# EAGLE design lin_master_node (EAGLE 6.5.0)
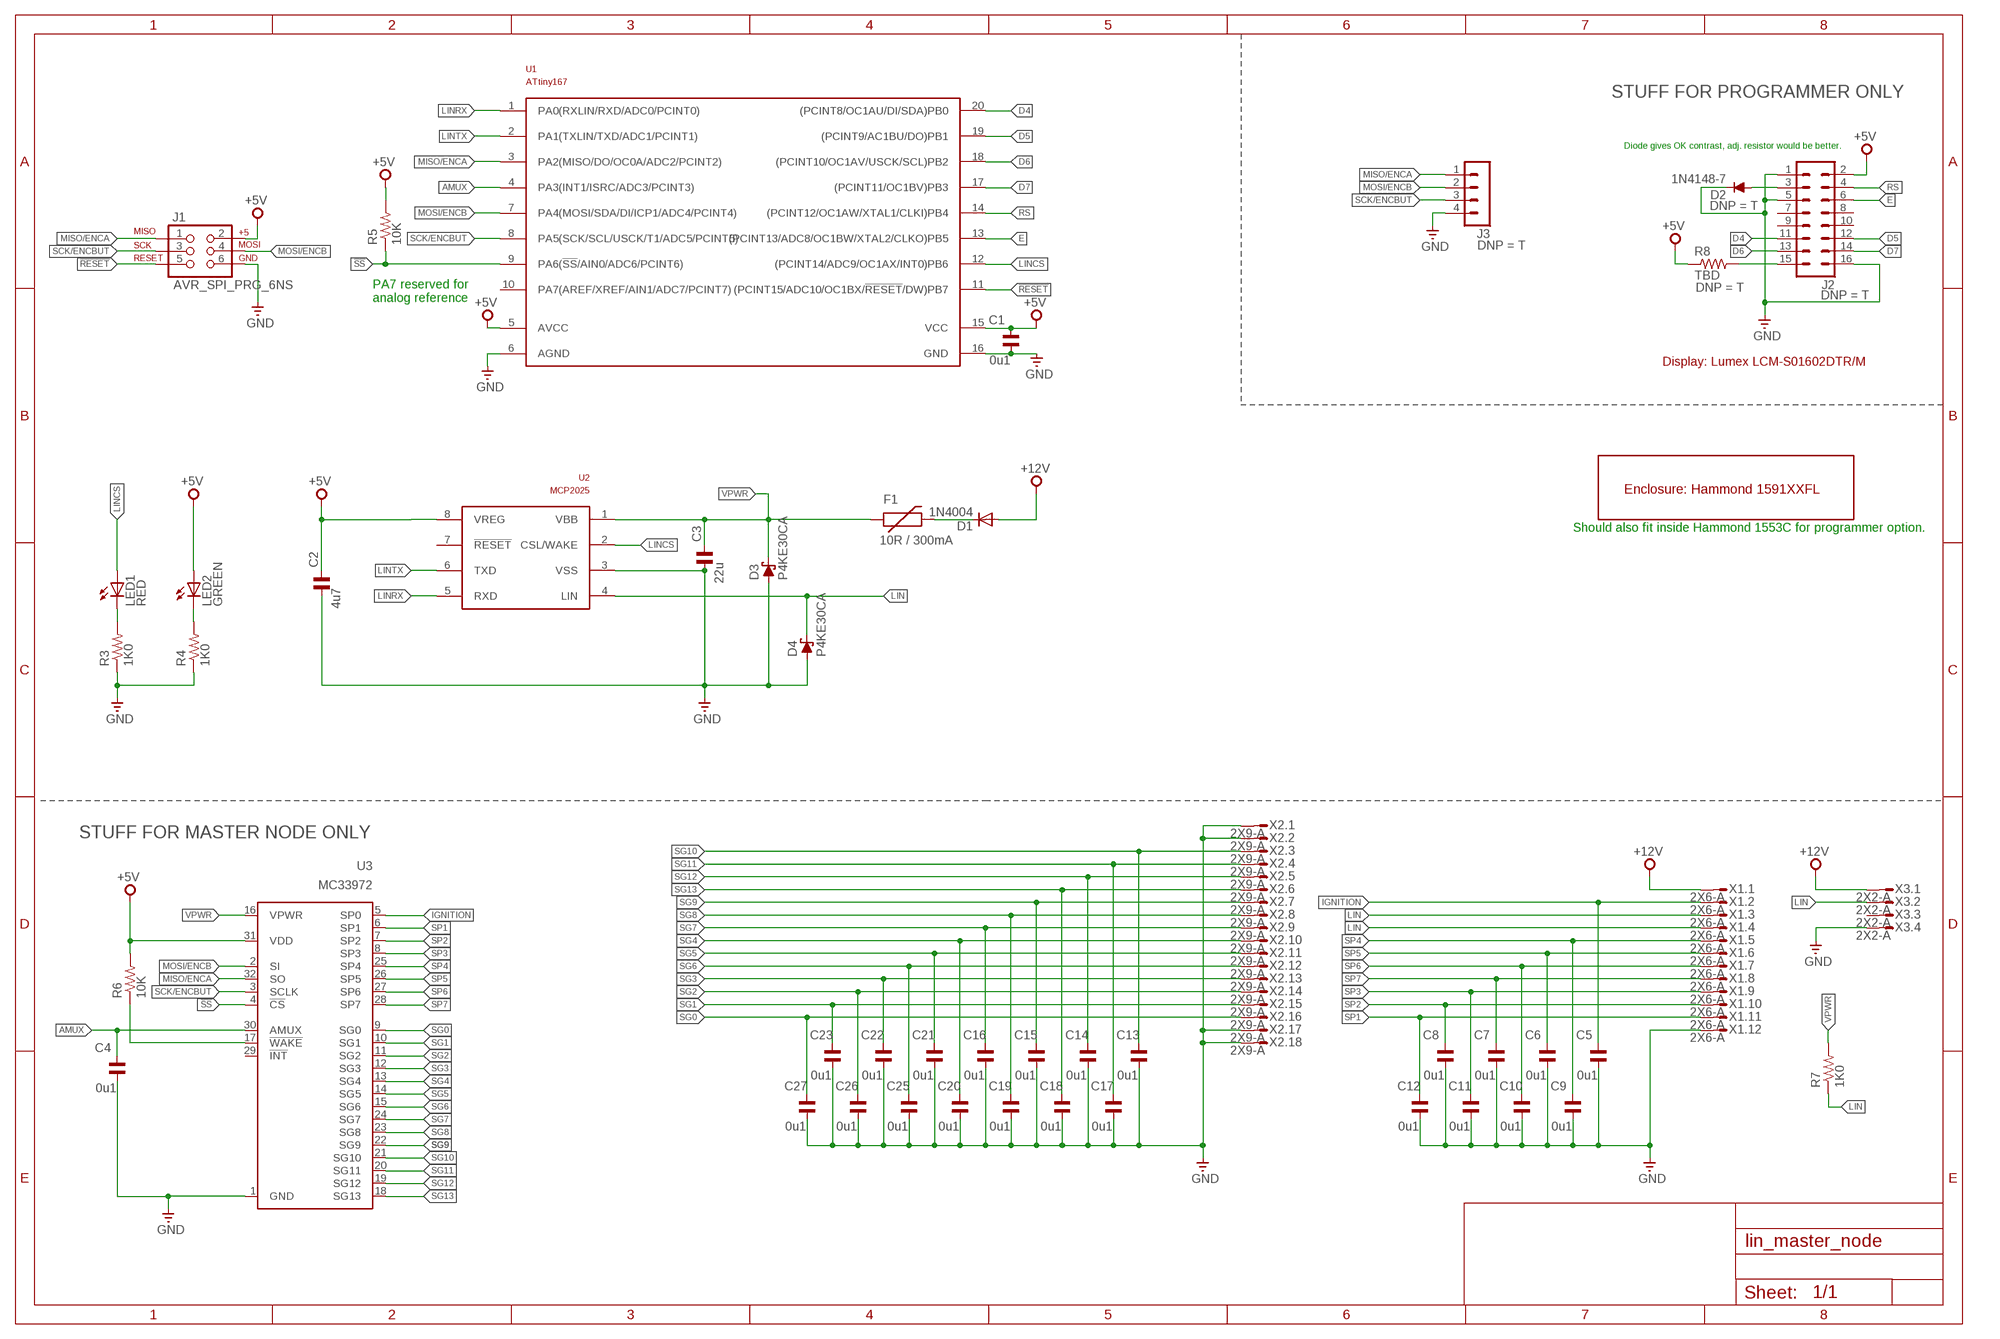
[diagram p0: schematic, sheet 1]

## Parts
C1  0u1  C-EU050-024X044  [C050-024X044]
C2  4u7  C-EU050-024X044  [C050-024X044]
C3  22u  C-EU050-024X044  [C050-024X044]
C4  0u1  C-EU050-024X044  [C050-024X044]
C5  0u1  C-EUC0603K  [C0603K]
C6  0u1  C-EUC0603K  [C0603K]
C7  0u1  C-EUC0603K  [C0603K]
C8  0u1  C-EUC0603K  [C0603K]
C9  0u1  C-EUC0603K  [C0603K]
C10  0u1  C-EUC0603K  [C0603K]
C11  0u1  C-EUC0603K  [C0603K]
C12  0u1  C-EUC0603K  [C0603K]
C13  0u1  C-EUC0603K  [C0603K]
C14  0u1  C-EUC0603K  [C0603K]
C15  0u1  C-EUC0603K  [C0603K]
C16  0u1  C-EUC0603K  [C0603K]
C17  0u1  C-EUC0603K  [C0603K]
C18  0u1  C-EUC0603K  [C0603K]
C19  0u1  C-EUC0603K  [C0603K]
C20  0u1  C-EUC0603K  [C0603K]
C21  0u1  C-EUC0603K  [C0603K]
C22  0u1  C-EUC0603K  [C0603K]
C23  0u1  C-EUC0603K  [C0603K]
C25  0u1  C-EUC0603K  [C0603K]
C26  0u1  C-EUC0603K  [C0603K]
C27  0u1  C-EUC0603K  [C0603K]
D1  1N4004  [DO41-10]
D2  1N4148-7  [DO35-7]
D3  P4KE30CA  P4KEXX  [DO41-10]
D4  P4KE30CA  P4KEXX  [DO41-10]
F1  10R / 300mA  PTCPTH  [PTC]
J1  AVR_SPI_PRG_6NS  [2X3-NS]
J2  MA08-2  [MA08-2]
J3  MA04-1  [MA04-1]
LED1  RED  LED3MM  [LED3MM]
LED2  GREEN  LED3MM  [LED3MM]
R3  1K0  R-EU_0207/10  [0207/10]
R4  1K0  R-EU_0207/10  [0207/10]
R5  10K  R-EU_0207/10  [0207/10]
R6  10K  R-EU_0207/10  [0207/10]
R7  1K0  R-EU_0207/10  [0207/10]
R8  TBD  R-EU_0207/10  [0207/10]
U1  ATtiny167  ATTINY167  [SO20W]
U2  MCP2025  [SO08]
U3  MC33972  [SOIC32W]
U$1  1591XXAFL  [1591XXAFL]
X1  2X6-A  [4-794618-2]
X2  2X9-A  [4-794618-8]
X3  2X2-A  [3-794618-4]

## Nets
!RESET: J1.5 U1.11((PCINT15/ADC10/OC1BX/!RESET!/DW)PB7)
!SS: R5.1 U1.9(PA6(!SS!/AIN0/ADC6/PCINT6)) U3.4(!CS)
+5V [power]: C1.1 C2.1 J1.2 J2.2 LED2.A R5.2 R6.2 R8.1 U1.5(AVCC) U1.15(VCC) U2.8(VREG) U3.31(VDD)
+12V [power]: D1.A X1.1 X3.1
AMUX: C4.1 U1.4(PA3(INT1/ISRC/ADC3/PCINT3)) U3.30(AMUX)
D4: J2.11 U1.20((PCINT8/OC1AU/DI/SDA)PB0)
D5: J2.12 U1.19((PCINT9/AC1BU/DO)PB1)
D6: J2.13 U1.18((PCINT10/OC1AV/USCK/SCL)PB2)
D7: J2.14 U1.17((PCINT11/OC1BV)PB3)
E: J2.6 U1.13((PCINT13/ADC8/OC1BW/XTAL2/CLKO)PB5)
GND [power]: C1.2 C2.2 C3.2 C4.2 C5.2 C6.2 C7.2 C8.2 C9.2 C10.2 C11.2 C12.2 C13.2 C14.2 C15.2 C16.2 C17.2 C18.2 C19.2 C20.2 C21.2 C22.2 C23.2 C25.2 C26.2 C27.2 D2.C D3.A D4.A J1.6 J2.1 J2.5 J2.16 J3.4 R3.1 R4.1 U1.6(AGND) U1.16(GND) U2.3(VSS) U3.1(GND) X1.12 X2.1 X2.2 X2.17 X2.18 X3.4
IGNITION: C5.1 U3.5(SP0) X1.2
LIN: D4.C R7.1 U2.4(LIN) X1.3 X1.4 X3.2
LINCS: LED1.A U1.12((PCINT14/ADC9/OC1AX/INT0)PB6) U2.2(CSL/WAKE)
LINRX: U1.1(PA0(RXLIN/RXD/ADC0/PCINT0)) U2.5(RXD)
LINTX: U1.2(PA1(TXLIN/TXD/ADC1/PCINT1)) U2.6(TXD)
MISO/ENCA: J1.1 J3.1 U1.3(PA2(MISO/DO/OC0A/ADC2/PCINT2)) U3.32(SO)
MOSI/ENCB: J1.4 J3.2 U1.7(PA4(MOSI/SDA/DI/ICP1/ADC4/PCINT4)) U3.2(SI)
N$1: LED1.K(C) R3.2
N$2: R6.1 U3.17(!WAKE)
N$4: LED2.K(C) R4.2
N$5 [power]: D1.C F1.P$2
N$10: J2.15 R8.2
N$12: D2.A J2.3
RS: J2.4 U1.14((PCINT12/OC1AW/XTAL1/CLKI)PB4)
SCK/ENCBUT: J1.3 J3.3 U1.8(PA5(SCK/SCL/USCK/T1/ADC5/PCINT5)) U3.3(SCLK)
SG0: C27.1 U3.9(SG0) X2.16
SG1: C23.1 U3.10(SG1) X2.15
SG2: C26.1 U3.11(SG2) X2.14
SG3: C22.1 U3.12(SG3) X2.13
SG4: C20.1 U3.13(SG4) X2.10
SG5: C21.1 U3.14(SG5) X2.11
SG6: C25.1 U3.15(SG6) X2.12
SG7: C16.1 U3.24(SG7) X2.9
SG8: C19.1 U3.23(SG8) X2.8
SG9: C15.1 U3.22(SG9) X2.7
SG10: C13.1 U3.21(SG10) X2.3
SG11: C17.1 U3.20(SG11) X2.4
SG12: C14.1 U3.19(SG12) X2.5
SG13: C18.1 U3.18(SG13) X2.6
SP1: C12.1 U3.6(SP1) X1.11
SP2: C8.1 U3.7(SP2) X1.10
SP3: C11.1 U3.8(SP3) X1.9
SP4: C9.1 U3.25(SP4) X1.5
SP5: C6.1 U3.26(SP5) X1.6
SP6: C10.1 U3.27(SP6) X1.7
SP7: C7.1 U3.28(SP7) X1.8
VPWR [power]: C3.1 D3.C F1.P$1 R7.2 U2.1(VBB) U3.16(VPWR)
Unconnected: J2.7 J2.8 J2.9 J2.10 U1.10(PA7(AREF/XREF/AIN1/ADC7/PCINT7)) U2.7(!RESET) U3.29(!INT) X3.3

## Notes on the sheet
- STUFF FOR PROGRAMMER ONLY
- Diode gives OK contrast, adj. resistor would be better.
- PA7 reserved for
  analog reference
- Display: Lumex LCM-S01602DTR/M
- Should also fit inside Hammond 1553C for programmer option.
- STUFF FOR MASTER NODE ONLY

## Library data of the parts
C1 C4 = custom:C-EU: CAPACITOR, European symbol; PARTNO: FK28X7R1H104K
C2 = custom:C-EU: CAPACITOR, European symbol; PARTNO: FK28X5R0J475K
C3 = custom:C-EU: CAPACITOR, European symbol; PARTNO: FK22X5R1E226M
C5-C23 C25-C27 = custom:C-EU: CAPACITOR, European symbol; PARTNO: C1608X7R1H104M080AA
D1 = custom:1N4004: DIODE general purpose rectifier, 1 A; PARTNO: 1N4004-TP
D2 = custom:1N4148: DIODE high speed (Philips); DNP: T; PARTNO: 1N4148TA
D3 D4 = custom:P4KEXX: DIODE transient-voltage suppressor; PARTNO: P4KE30CA
F1 = custom:PTC: Resettable Fuse PTC Resettable Fuse. Spark Fun Electronics SKU : COM-08357; PARTNO: CMF-RL10-0
J1 = custom:AVR_SPI_PRG_6: AVR ISP 6 Pin This is the reduced ISP connector for AVR programming. Common on Arduino. This footprint will take up less PCB space and can be used with a 10-pin to 6-pin adapter such as SKU: BOB-08508
J2 = custom:MA08-2: PIN HEADER; DNP: T
J3 = custom:MA04-1: PIN HEADER; DNP: T
LED1 = custom:LED: LEDs Standard schematic elements and footprints for 5mm, 3mm, 1206, and 0603 sized LEDs. 5mm - Spark Fun Electronics SKU : COM-00529 (and others); PARTNO: C4SMF-RJS-CT0W0BB2
LED2 = custom:LED: LEDs Standard schematic elements and footprints for 5mm, 3mm, 1206, and 0603 sized LEDs. 5mm - Spark Fun Electronics SKU : COM-00529 (and others); PARTNO: C4SMF-GJS-CV0Y0792
R3 R4 R7 = custom:R-EU_: RESISTOR, European symbol; PARTNO: CF14JT1K00
R5 R6 = custom:R-EU_: RESISTOR, European symbol; PARTNO: CF14JT10K0
R8 = custom:R-EU_: RESISTOR, European symbol; DNP: T
U1 = custom:ATTINY167; PARTNO: ATTINY167-SU
U2 = custom:MCP2025: LIN Transceiver with Voltage Regulator; PARTNO: MCP2025-500E/SN
U3 = custom:MC33972: edit this description Auto generated by make-symbol-device-package-bsdl.ulp Rev. 43 Source:; PARTNO: MC33972ATEW
U$1 = custom:1591XXAFL; PARTNO: 1591XXAFLBK
X1 = custom:2X6; PARTNO: 4-794618-2
X2 = custom:2X9; PARTNO: 4-794618-8
X3 = custom:2X2; PARTNO: 3-794618-4

## Net classes
0 default: width 0.381 mm
1 power: width 0.635 mm

## Board
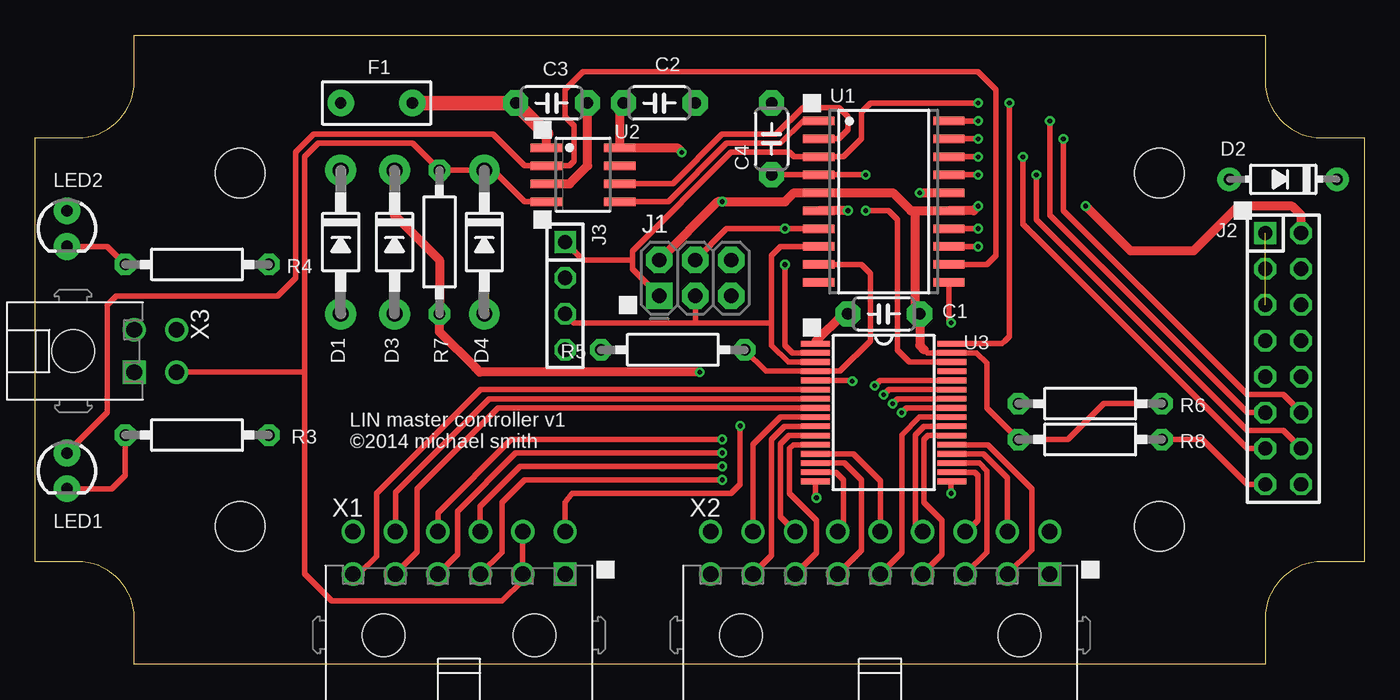
[diagram p1: board, top side]
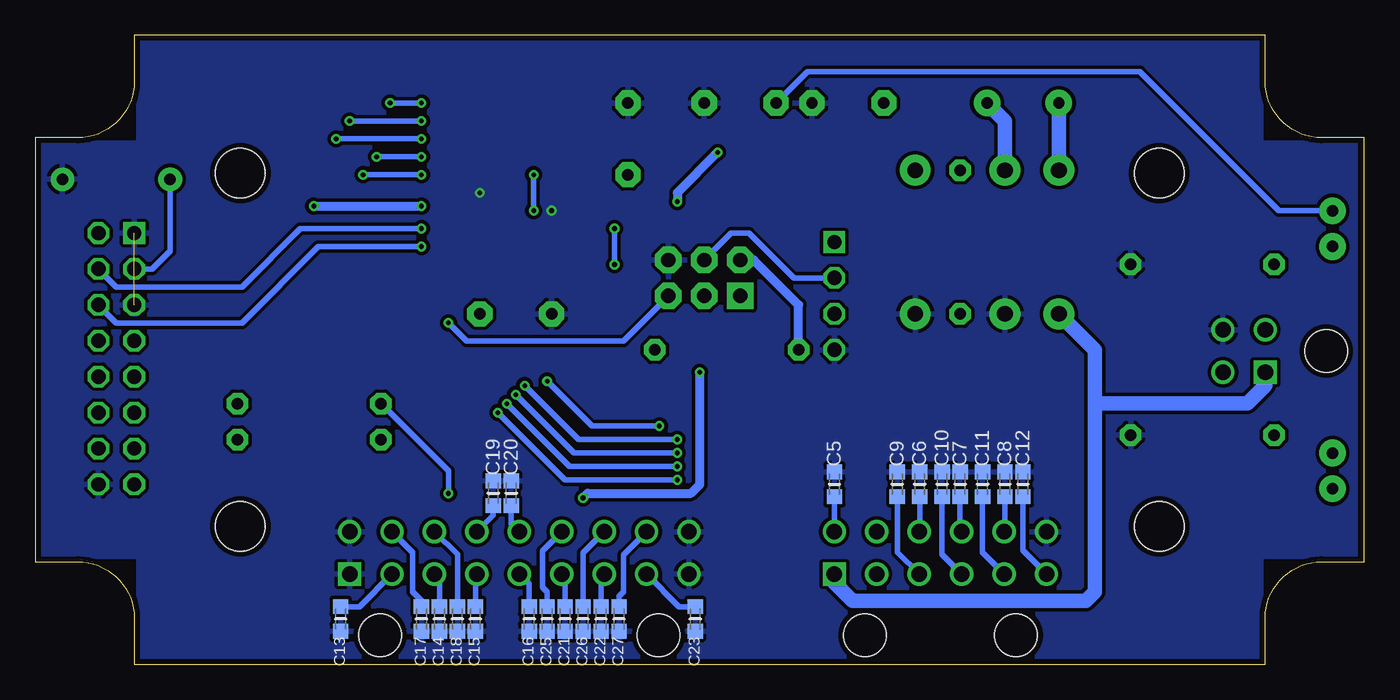
[diagram p2: board, bottom side, seen from below]

Size 94 x 44.5 mm. Coordinates in mm from the lower left corner, seen from the top.
Copper layers (1*16): Top 0.0356mm / dielectric 1.5011mm / Bottom 0.0356mm
Design rules "LaenPCBOrder": minimum track width 6mil, minimum drill 13mil, track to track 6mil, track to pad 6mil, pad to pad 6mil, via to via 6mil, smd to smd 6mil, copper to edge 15mil, drill to drill 6mil, minimum pad ring 7mil, minimum via ring 7mil, stop-mask expansion 3mil, vias tented up to drill 0mil, thermal gap 10mil

### Footprints (pad centres in the part's own frame; a part is rotated, then mirrored left to right if it is on the bottom)
C050-024X044 = drill 0.813 pad 1.778 octagon: 1 -2.54,0; 2 2.54,0
C0603K = smd 1.05 x 1.08: 1 -0.875,0; 2 0.875,0
DO41-10 = drill 1.118 pad 2.184: A 5.08,0; C -5.08,0
DO35-7 = drill 0.813 pad 1.676: A 3.81,0; C -3.81,0
PTC = drill 0.8 pad 1.88: P$1 -2.54,0; P$2 2.54,0
2X3-NS = drill 1.016 pad 1.88 square: 1 -2.54,-1.27 | drill 1.016 pad 1.88 octagon: 2 -2.54,1.27; 3 0,-1.27; 4 0,1.27; 5 2.54,-1.27; 6 2.54,1.27
MA08-2 = drill 1.016 square: 1 -8.89,-1.27 | drill 1.016 octagon: 2 -8.89,1.27; 3 -6.35,-1.27; 4 -6.35,1.27; 5 -3.81,-1.27; 6 -3.81,1.27; 7 -1.27,-1.27; 8 -1.27,1.27; 9 1.27,-1.27; 10 1.27,1.27; 11 3.81,-1.27; 12 3.81,1.27; 13 6.35,-1.27; 14 6.35,1.27; 15 8.89,-1.27; 16 8.89,1.27
MA04-1 = drill 1.016 square: 1 -3.81,0 | drill 1.016 octagon: 2 -1.27,0; 3 1.27,0; 4 3.81,0
LED3MM = drill 0.813 pad 1.88: A -1.27,0; K 1.27,0
0207/10 = drill 0.813 pad 1.524 octagon: 1 -5.08,0; 2 5.08,0
SO20W = smd 0.6 x 2.2: 1 -5.715,-4.6; 2 -4.445,-4.6; 3 -3.175,-4.6; 4 -1.905,-4.6; 5 -0.635,-4.6; 6 0.635,-4.6; 7 1.905,-4.6; 8 3.175,-4.6; 9 4.445,-4.6; 10 5.715,-4.6; 11 5.715,4.6; 12 4.445,4.6; 13 3.175,4.6; 14 1.905,4.6; 15 0.635,4.6; 16 -0.635,4.6; 17 -1.905,4.6; 18 -3.175,4.6; 19 -4.445,4.6; 20 -5.715,4.6
SO08 = smd 0.6 x 2.2: 1 -1.905,-2.6; 2 -0.635,-2.6; 3 0.635,-2.6; 4 1.905,-2.6; 5 1.905,2.6; 6 0.635,2.6; 7 -0.635,2.6; 8 -1.905,2.6
SOIC32W = smd 2.05 x 0.4: 1 -4.825,4.875; 2 -4.825,4.225; 3 -4.825,3.575; 4 -4.825,2.925; 5 -4.825,2.275; 6 -4.825,1.625; 7 -4.825,0.975; 8 -4.825,0.325; 9 -4.825,-0.325; 10 -4.825,-0.975; 11 -4.825,-1.625; 12 -4.825,-2.275; 13 -4.825,-2.925; 14 -4.825,-3.575; 15 -4.825,-4.225; 16 -4.825,-4.875; 17 4.825,-4.875; 18 4.825,-4.225; 19 4.825,-3.575; 20 4.825,-2.925; 21 4.825,-2.275; 22 4.825,-1.625; 23 4.825,-0.975; 24 4.825,-0.325; 25 4.825,0.325; 26 4.825,0.975; 27 4.825,1.625; 28 4.825,2.275; 29 4.825,2.925; 30 4.825,3.575; 31 4.825,4.225; 32 4.825,4.875
1591XXAFL = hole 3.5: -32.5,12.5; 32.5,12.5; -32.5,-12.5; 32.5,-12.5
4-794618-2 = drill 1.1 square: 1 0,0 | drill 1.1: 2 0,3; 3 -3,0; 4 -3,3; 5 -6,0; 6 -6,3; 7 -9,0; 8 -9,3; 9 -12,0; 10 -12,3; 11 -15,0; 12 -15,3 | hole 3: -2.15,-4.32; -12.85,-4.32
4-794618-8 = drill 1.1 square: 1 0,0 | drill 1.1: 2 0,3; 3 -3,0; 4 -3,3; 5 -6,0; 6 -6,3; 7 -9,0; 8 -9,3; 9 -12,0; 10 -12,3; 11 -15,0; 12 -15,3; 13 -18,0; 14 -18,3; 15 -21,0; 16 -21,3; 17 -24,0; 18 -24,3 | hole 3: -2.15,-4.32; -21.85,-4.32
3-794618-4 = drill 1.1 square: 1 0,0 | drill 1.1: 2 0,3; 3 -3,0; 4 -3,3 | hole 3: -1.5,-4.32

### Placement (x,y rotation side)
C1  60.02,24.79 180 top
C2  44.14,39.71 0 top
C3  36.52,39.71 0 top
C4  52.08,37.17 90 top
C5  37.48,12.73 90 bottom
C6  31.44,12.73 90 bottom
C7  28.58,12.73 90 bottom
C8  25.41,12.73 90 bottom
C9  33.03,12.73 90 bottom
C10  29.85,12.73 90 bottom
C11  27,12.73 90 bottom
C12  24.14,12.73 90 bottom
C13  72.4,3.2 270 bottom
C14  65.41,3.2 270 bottom
C15  62.88,3.2 270 bottom
C16  59.06,3.2 270 bottom
C17  66.69,3.2 270 bottom
C18  64.15,3.2 270 bottom
C19  61.6,12.09 90 bottom
C20  60.34,12.09 90 bottom
C21  56.52,3.2 270 bottom
C22  53.98,3.2 270 bottom
C23  47.32,3.2 270 bottom
C25  57.79,3.2 270 bottom
C26  55.25,3.2 270 bottom
C27  52.71,3.2 270 bottom
D1  21.6,29.87 270 top
D2  88.28,34.31 180 top
D3  25.41,29.87 270 top
D4  31.76,29.87 270 top
F1  24.14,39.71 180 top
J1  46.68,27.33 0 top
J2  88.28,21.62 270 top
J3  37.48,26.06 270 top
LED1  2.23,13.68 270 top
LED2  2.23,30.82 270 top
R3  11.44,16.22 180 top
R4  11.44,28.28 180 top
R5  45.09,22.25 180 top
R6  74.62,18.44 0 top
R7  28.58,29.87 270 top
R8  74.62,15.9 0 top
U1  60.02,32.73 270 top
U2  38.74,34.63 270 top
U3  60.02,17.8 0 top
U$1  47,22.25 0 top
X1  37.48,6.38 0 top
X2  71.76,6.38 0 top
X3  6.99,20.66 270 top

### Tracks (layer width: path | path; a pad name or v marks a point on that pad's centre or on a via)
!RESET  (via drill 0.33)
  Top 0.381: v64.78,24.16 64.62,24.32 U1.11
  Bottom 0.381: J1.5 52.4,22.89 63.51,22.89 v64.78,24.16
!SS
  Top 0.381: U1.9 58.43,28.28 59.06,27.65 59.06,22.89 56.91,20.73 U3.4 51.7,20.73 R5.1
+5V  (via drill 0.33)
  Top 0.381: 62.88,22.25 63.09,22.03 U3.31 66.59,22.03 67.32,21.3 67.32,18.12 R8.1 73.03,15.9 75.57,18.44 R6.2
  Top 0.635: 62.88,22.25 62.56,22.57 C1.1 62.24,25.11 62.24,32.09 | C2.1 41.34,39.45 U2.8 45.41,36.54 v45.73,36.22 | J1.2 48.27,32.73 v48.59,32.73 53.03,32.73 53.67,33.36 U1.5 60.65,33.36 61.92,32.09 62.24,32.09 | J2.2 89.54,31.77 88.91,32.41 85.1,32.41 81.93,29.23 77.48,29.23 v74.31,32.41 | v66.69,32.41 66.37,32.09 U1.15 62.24,32.09
  Bottom 0.381: C2.1 39.38,41.94 15.88,41.94 6.04,32.09 LED2.A
  Bottom 0.635: R5.2 40.02,25.43 43.19,28.6 J1.2 | v45.73,36.22 48.59,33.36 v48.59,32.73 | v74.31,32.41 v66.69,32.41
+12V
  Bottom 1.016: X1.1 37.48,5.74 36.2,4.47 19.69,4.47 19.06,5.11 19.06,18.44 | 19.06,18.44 19.06,22.25 D1.A | X3.1 6.99,19.71 8.26,18.44 19.06,18.44
AMUX  (via drill 0.33)
  Top 0.381: U3.30 61.84,21.38 60.97,22.25 60.97,31.46 60.34,32.09 v58.75,32.09 | v58.75,34.63 U1.4 C4.1
  Bottom 0.381: v58.75,32.09 v58.75,34.63
D4  (via drill 0.33)
  Top 0.381: J2.11 85.73,17.8 71.76,31.77 v71.76,38.44 | v66.69,38.44 U1.20
  Bottom 0.381: v71.76,38.44 v66.69,38.44
D5  (via drill 0.33)
  Top 0.381: J2.12 88.28,19.07 85.73,19.07 72.72,32.09 v72.72,37.17 | v66.69,37.17 U1.19
  Bottom 0.381: v72.72,37.17 v66.69,37.17
D6  (via drill 0.33)
  Top 0.381: J2.13 85.73,15.27 69.86,31.14 v69.86,35.9 | v66.69,35.9 U1.18
  Bottom 0.381: v69.86,35.9 v66.69,35.9
D7  (via drill 0.33)
  Top 0.381: J2.14 88.28,16.54 85.73,16.54 70.81,31.46 v70.81,34.63 | v66.69,34.63 U1.17
  Bottom 0.381: v70.81,34.63 v66.69,34.63
E  (via drill 0.33)
  Top 0.381: v66.69,29.55 U1.13
  Bottom 0.381: J2.6 88.28,24.16 79.38,24.16 73.99,29.55 v66.69,29.55
GND  (via drill 0.33)  (1 unrouted)
  Top 0.381: U3.1 55.19,22.82
  Top 0.635: v62.56,33.36 U1.16 | v57.48,32.09 U1.6 | U2.3 37.79,34 39.06,35.27 C3.2 | 55.19,22.82 57.16,24.79 C1.2
  pour Bottom (isolate 0.254): 0.64,7.65 0.64,36.86 7.31,36.86 7.31,44.16 86.69,44.16 86.69,36.86 93.67,36.86 93.67,7.65 86.69,7.65 86.69,0.34 7.31,0.34 7.31,7.65
IGNITION  (via drill 0.33)
  Top 0.381: v49.86,16.85 49.86,12.73 49.22,12.09 37.97,12.09 37.48,11.46 X1.2 | v57.79,20.03 57.74,20.08 U3.5
  Bottom 0.381: v49.86,16.85 54.62,16.85 v57.79,20.03 | C5.1 X1.2
LIN
  Top 0.381: U2.4 34.62,32.73 32.39,34.95 D4.C R7.1 26.68,36.86 20.01,36.86 19.06,35.9 19.06,20.66 | X1.4 X1.3 34.48,5.92 33.03,4.47 20.96,4.47 19.06,6.38 19.06,20.66 | X3.2 19.06,20.66
LINCS
  Top 0.381: U1.12 67.32,28.28 67.95,28.92 67.95,40.66 66.69,41.94 38.74,41.94 37.48,40.66 37.48,38.76 38.11,38.12 38.11,35.59 37.79,35.27 U2.2 34.62,35.27 32.39,37.49 19.69,37.49 18.42,36.22 18.42,27.33 17.15,26.06 5.72,26.06 5.09,25.43 5.09,17.8 LED1.A
LINRX
  Top 0.381: U2.5 44.78,32.73 48.91,36.86 52.71,36.86 54.3,38.44 U1.1
LINTX
  Top 0.381: U2.6 45.09,34 48.59,37.49 52.4,37.49 54.3,39.4 56.84,39.4 57.48,38.76 57.48,37.81 56.84,37.17 U1.2
MISO/ENCA  (via drill 0.33)
  Top 0.381: v68.91,39.71 68.91,26.75 68.91,23.2 68.59,22.89 68.38,22.68 U3.32 | v66.69,39.71 59.06,39.71 58.43,39.08 58.43,37.17 57.16,35.9 U1.3 53.67,35.9 53.35,36.22 49.22,36.22 42.24,29.23 42.24,28.6 | 42.24,28.6 42.24,27.96 J1.1 | J3.1 38.74,28.6 42.24,28.6
  Bottom 0.381: v68.91,39.71 v66.69,39.71
MOSI/ENCB  (via drill 0.33)
  Top 0.381: J1.4 48.91,30.82 v53.03,30.82 U1.7 | U3.2 53.57,22.03 53.03,22.57 v53.03,28.28
  Bottom 0.381: v53.03,28.28 v53.03,30.82 | J3.2 40.33,27.33 43.51,30.5 44.78,30.5 J1.4
N$1
  Top 0.381: LED1.K 5.41,12.41 6.36,13.36 R3.2
N$2  (via drill 0.33)
  Top 0.381: v64.78,12.09 64.78,12.87 U3.17
  Bottom 0.381: R6.1 64.78,13.68 v64.78,12.09
N$4
  Top 0.381: LED2.K 5.09,29.55 R4.2
N$5
  Bottom 1.016: D1.C F1.P$2
N$10
  Top 0.381: R8.2 82.56,15.9 85.73,12.73 J2.15
N$12
  Bottom 0.381: J2.3 85.73,27.96 84.47,29.23 D2.A
RS  (via drill 0.33)
  Top 0.381: v66.69,30.82 U1.14
  Bottom 0.381: J2.4 88.28,26.7 79.38,26.7 75.26,30.82 v66.69,30.82
SCK/ENCBUT
  Top 0.381: U3.3 53.27,21.38 52.08,22.57 52.08,24.16 | 52.08,24.16 52.08,28.92 52.71,29.55 U1.8 | J3.3 38.11,24.16 46.36,24.16 46.68,24.16 | 46.68,24.16 52.08,24.16 | J1.3 46.68,24.16
SG0
  Top 0.381: X2.16 50.77,15.54 52.71,17.48 U3.9
  Bottom 0.381: X2.16 52.4,7.74 52.4,5.11 52.71,4.79 C27.1
SG1
  Top 0.381: X2.15 52.08,7.69 52.08,15.9 53.01,16.83 U3.10
  Bottom 0.381: C23.1 48.46,4.08 X2.15
SG2
  Top 0.381: X2.14 52.71,10.43 52.71,15.58 53.31,16.18 U3.11
  Bottom 0.381: X2.14 55.25,7.88 C26.1
SG3
  Top 0.381: U3.12 53.61,15.53 53.35,15.27 53.35,12.09 55.25,10.19 55.25,7.87 X2.13
  Bottom 0.381: X2.13 53.98,6.16 C22.1
SG4
  Top 0.381: X2.10 59.77,12.98 57.86,14.88 U3.13
  Bottom 0.381: X2.10 60.34,9.95 C20.1
SG5
  Top 0.381: X2.11 58.43,8.04 58.43,13.04 57.24,14.23 U3.14
  Bottom 0.381: X2.11 56.52,6.14 C21.1
SG6
  Top 0.381: X2.12 56.77,9.47 57.16,9.87 57.16,13.04 56.62,13.58 U3.15
  Bottom 0.381: X2.12 58.11,8.03 58.11,5.42 57.79,5.11 C25.1
SG7
  Top 0.381: X2.9 61.29,7.9 61.29,16.22 62.55,17.48 U3.24
  Bottom 0.381: X2.9 59.06,5.68 C16.1
SG8
  Top 0.381: X2.8 62.77,9.34 62.24,9.87 62.24,16.22 62.85,16.83 U3.23
  Bottom 0.381: C19.1 61.6,10.54 X2.8
SG9
  Top 0.381: X2.7 64.15,7.76 64.15,10.19 62.88,11.46 62.88,15.9 63.16,16.18 U3.22
  Bottom 0.381: C15.1 62.88,6.27 X2.7
SG10
  Top 0.381: X2.3 70.5,8.11 70.5,12.41 67.37,15.53 U3.21
  Bottom 0.381: C13.1 71.06,4.08 X2.3
SG11
  Top 0.381: X2.4 68.76,13.19 67.07,14.88 U3.20
  Bottom 0.381: C17.1 66.69,4.47 67.32,5.11 67.32,7.93 X2.4
SG12
  Top 0.381: X2.5 67.32,7.93 67.32,13.68 66.77,14.23 U3.19
  Bottom 0.381: C14.1 65.41,6.03 X2.5
SG13
  Top 0.381: X2.6 65.76,9.27 66.69,10.19 66.69,13.36 66.47,13.58 U3.18
  Bottom 0.381: C18.1 64.15,7.76 X2.6
SP1
  Top 0.381: X1.11 22.87,6.38 24.14,7.65 24.14,12.09 31.48,19.43 U3.6
  Bottom 0.381: C12.1 24.14,8.04 X1.11
SP2
  Top 0.381: X1.10 25.47,12.16 32.1,18.78 U3.7
  Bottom 0.381: C8.1 25.41,9.44 X1.10
SP3
  Top 0.381: X1.9 25.47,6.44 27,7.96 27,12.41 32.72,18.13 U3.8
  Bottom 0.381: X1.9 27,7.9 C11.1
SP4  (via drill 0.33)
  Top 0.381: X1.5 33.03,7.93 33.03,11.46 34.62,13.04 v48.59,13.04 | U3.25 61.61,18.13 v61.29,17.8
  Bottom 0.381: v48.59,13.04 56.52,13.04 v61.29,17.8 | X1.5 33.03,7.93 C9.1
SP5  (via drill 0.33)
  Top 0.381: X1.6 31.47,11.17 34.3,14 v48.59,14 | U3.26 60.99,18.78 v60.65,18.44
  Bottom 0.381: v48.59,14 56.21,14 v60.65,18.44 | C6.1 31.44,9.41 X1.6
SP6  (via drill 0.33)
  Top 0.381: X1.7 29.85,7.76 29.85,10.82 33.98,14.95 v48.59,14.95 | U3.27 60.37,19.43 v60.02,19.07
  Bottom 0.381: v48.59,14.95 55.89,14.95 v60.02,19.07 | X1.7 29.85,7.76 C10.1
SP7  (via drill 0.33)
  Top 0.381: X1.8 28.47,10.71 33.66,15.9 v48.59,15.9 | U3.28 59.75,20.08 v59.38,19.71
  Bottom 0.381: v48.59,15.9 55.57,15.9 v59.38,19.71 | C7.1 28.58,9.49 X1.8
VPWR  (via drill 0.33)
  Top 0.381: U3.16 55.19,11.84
  Top 0.635: 36.14,37.55 U2.1 | 55.19,11.84 v55.25,11.77 | D3.C 25.41,31.77 28.58,28.6 R7.2 28.58,23.52 31.12,20.98 31.44,20.66 v47,20.66
  Top 1.016: 36.14,37.55 C3.1 F1.P$1
  Bottom 0.635: v55.25,11.77 54.94,12.09 47.63,12.09 47,12.73 v47,20.66
  Bottom 1.016: D3.C 25.41,38.44 F1.P$1

### Text on the board
tPlace: LIN master controller v1 / ©2014 michael smith